# EAGLE design SenseLora Soil Moisture V1.0 (EAGLE 6.1)
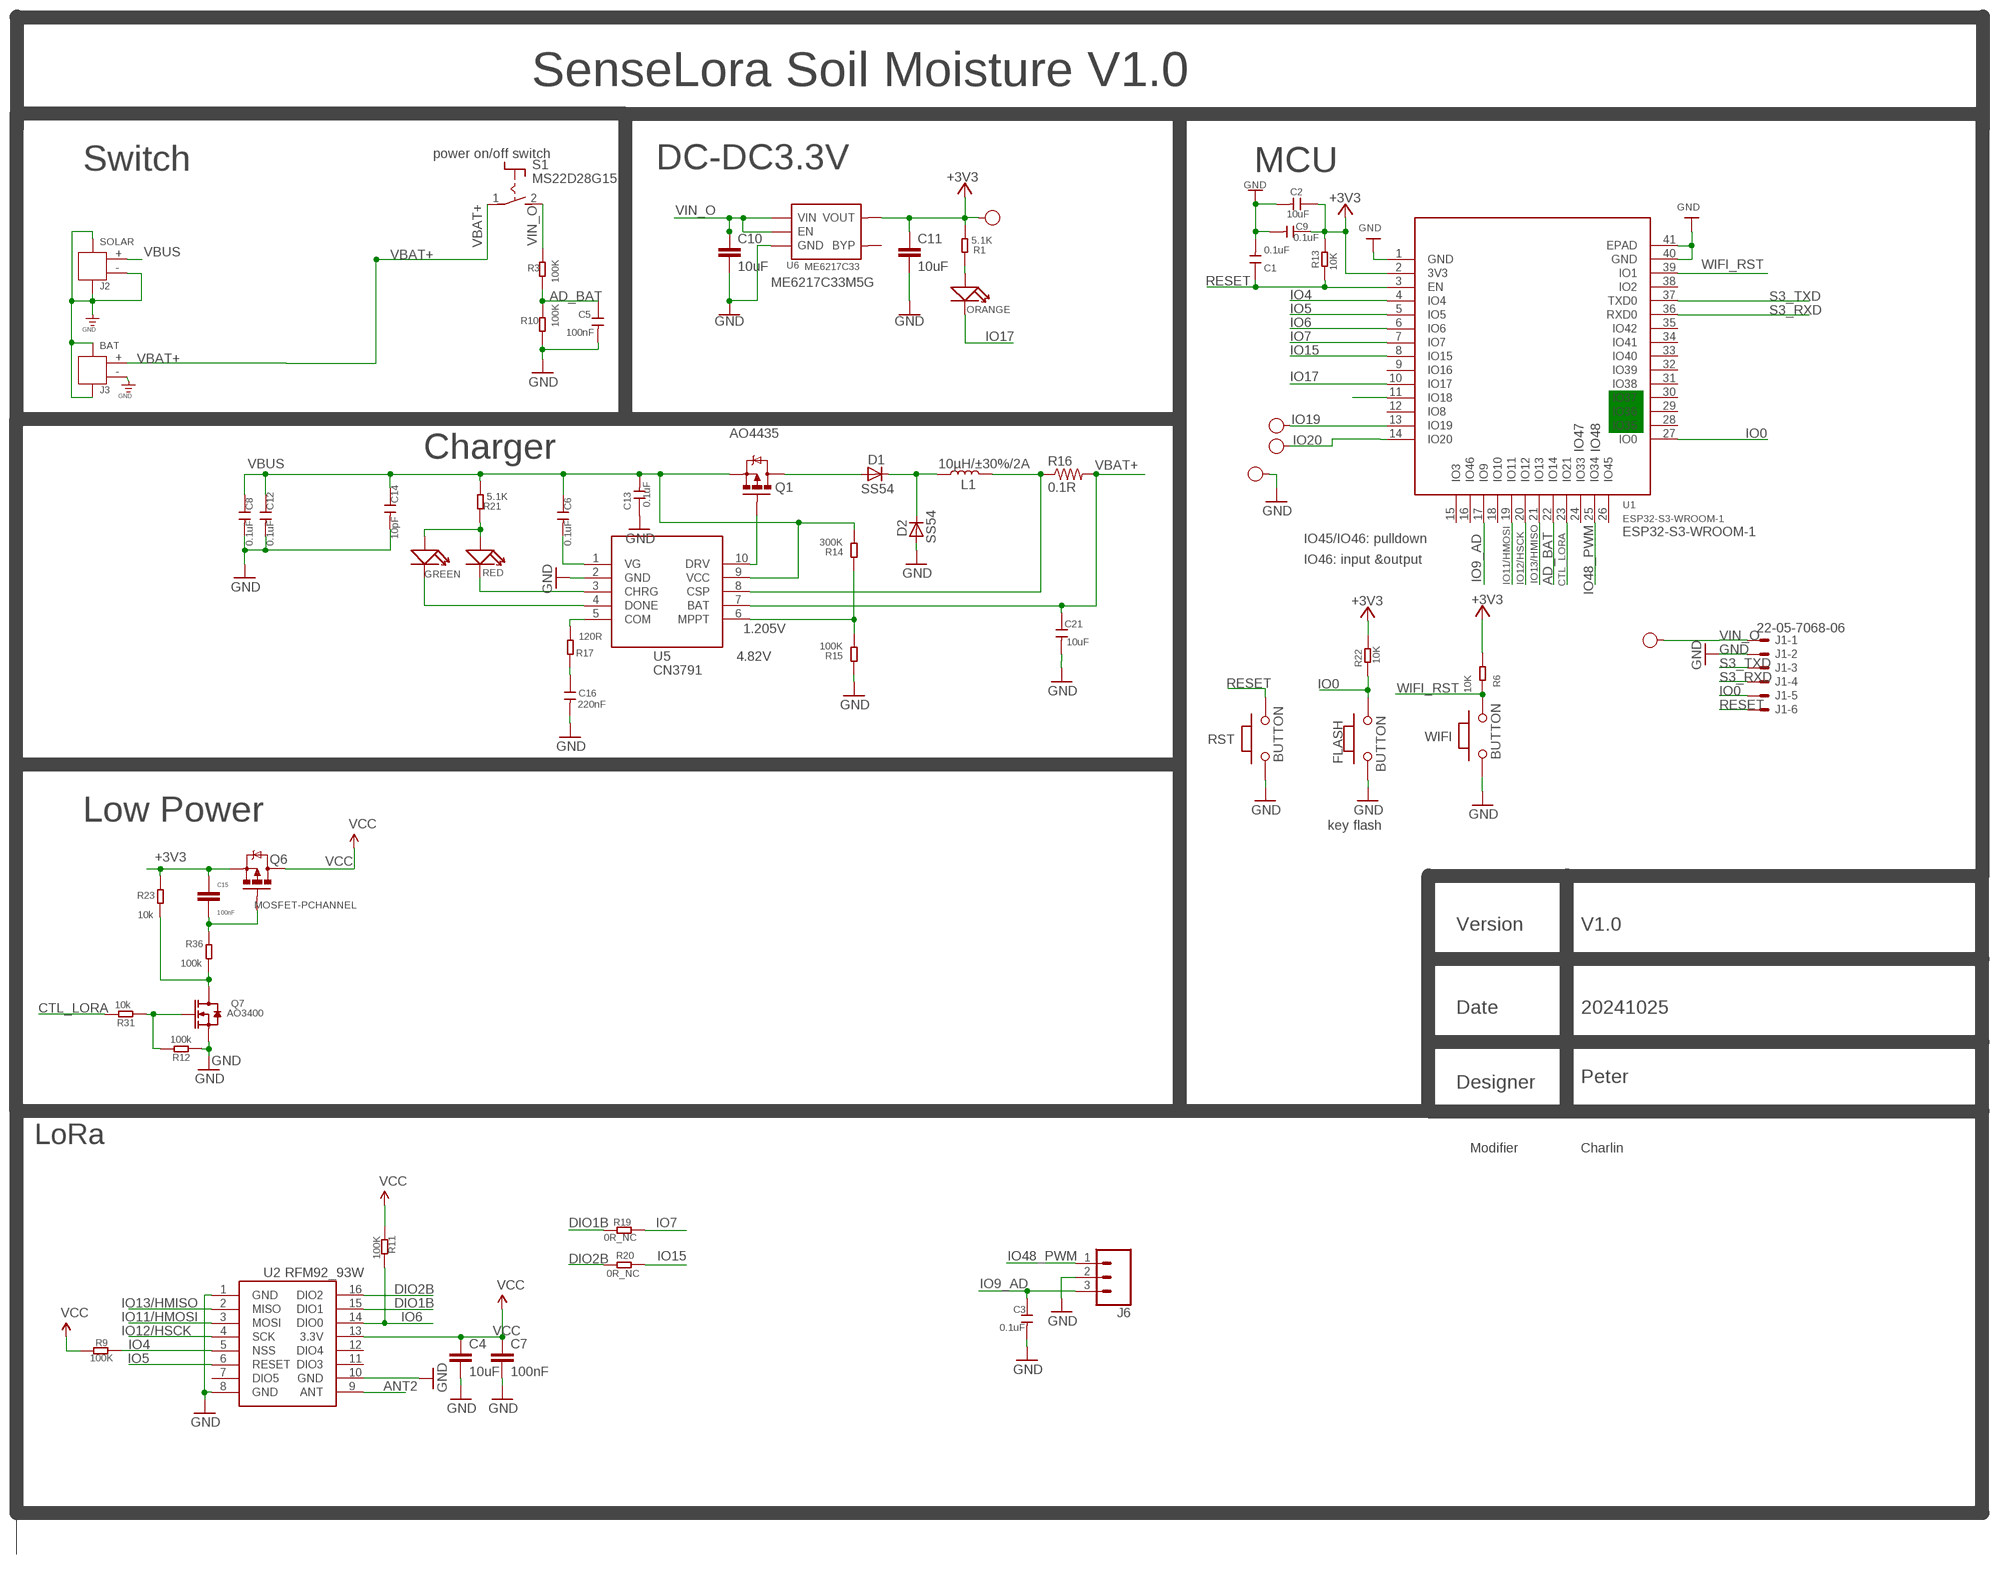
[diagram p0: schematic, sheet 1]

## Parts
3V3  TEST-POINT'4545'  [TP-D45MIL]
C1  0.1uF  DISCRETE_C-0603  [DISCRETE_C0603]
C2  10uF  DISCRETE_C-0603  [DISCRETE_C0603]
C3  0.1uF  DISCRETE_C-0603  [DISCRETE_C0603]
C4  10uF  C0603  [C0603]
C5  100nF  CAP-0603  [C0603]
C6  0.1uF  DISCRETE_C-0603  [DISCRETE_C0603]
C7  100nF  C0603  [C0603]
C8  0.1uF  DISCRETE_C-0603  [DISCRETE_C0603]
C9  0.1uF  DISCRETE_C-0603  [DISCRETE_C0603]
C10  10uF  C0603  [C0603]
C11  10uF  C0603  [C0603]
C12  0.1uF  DISCRETE_C-0603  [DISCRETE_C0603]
C13  0.1uF  DISCRETE_C-0603  [DISCRETE_C0603]
C14  10pF  DISCRETE_C-0603  [DISCRETE_C0603]
C15  100nF  C0603  [C0603]
C16  220nF  DISCRETE_C-0603  [DISCRETE_C0603]
C21  10uF  DISCRETE_C-0603  [DISCRETE_C0603]
CHRG  RED  LED'0603'  [LED-0603]
D1  SS54  DIODE-DO-214AC  [DO-214AC]
D2  SS54  DIODE-DO-214AC  [DO-214AC]
D+  TEST-POINT'4545'  [TP-D45MIL]
D-  TEST-POINT'4545'  [TP-D45MIL]
DONE  GREEN  LED'0603'  [LED-0603]
FLASH  BUTTON  PB157  [157SW]
GND  TEST-POINT'4545'  [TP-D45MIL]
J1  22-05-7068-06  [7395-06]
J2  SOLAR  JST-2P-SMD'2.0'  [HW2-SMD-2.0-90D]
J3  BAT  JST-2P-SMD'2.0'  [HW2-SMD-2.0-90D]
J6  CONN_03SCREW  [SCREWTERMINAL-3.5MM-3]
L1  10µH/±30%/2A  INDUCTOR-CR54-3.3UH  [CR54]
Q1  MOSFET-PCHANNELFDS6675  [SO08]
Q6  MOSFET-PCHANNEL  [SOT23-3]
Q7  AO3400  MOSFET-N'SOT23'  [SOT23@1]
R1  5.1K  DISCRETE_R-0603  [DISCRETE_R0603]
R3  100K  R-0603  [R0603]
R6  10K  R-0603  [R0603]
R9  100K  R-0603  [R0603]
R10  100K  R-0603  [R0603]
R11  100K  R-0603  [R0603]
R12  100k  R-0603  [R0603]
R13  10K  R-0603  [R0603]
R14  300K  DISCRETE_R-0603  [DISCRETE_R0603]
R15  100K  DISCRETE_R-0603  [DISCRETE_R0603]
R16  0.1R  R-US_R1206  [R1206]
R17  120R  DISCRETE_R-0603  [DISCRETE_R0603]
R19  0R_NC  R-0603  [R0603]
R20  0R_NC  R-0603  [R0603]
R21  5.1K  DISCRETE_R-0603  [DISCRETE_R0603]
R22  10K  R-0603  [R0603]
R23  10k  R-0603  [R0603]
R31  10k  R-0603  [R0603]
R36  100k  R-0603  [R0603]
RST  BUTTON  PB157  [157SW]
S1  MS22D28G15  [S-MS22D28G15]
STA  ORANGE  LED'0603'  [LED-0603]
U1  ESP32-S3-WROOM-1  ESP32­S2­SOLO  [ESP32-­S2-­SOLO]
U2  RFM92_93W  [RFM92_93W]
U5  CN3791  [SSOP-10-150MIL]
U6  ME6217C33  SPX3819  [SOT23-5]
VI  HP  TEST-POINT'4545'  [TP-D45MIL]
WIFI  BUTTON  PB157  [157SW]

## Nets
+3V3: 3V3.T C2.1 C9.1 C11.1 C15.1 Q6.2(S) R1.2 R6.2 R13.2 R22.2 R23.2 U1.2(3V3) U6.5(VOUT)
AD_BAT: C5.1 R3.2 R10.1 U1.22(IO14)
ANT2: U2.9(ANT)
CTL_LORA: R31.2 U1.23(IO21)
DIO1B: R19.2 U2.15(DIO1)
DIO2B: R20.2 U2.16(DIO2)
GND: C1.2 C2.2 C3.2 C4.2 C5.2 C7.2 C8.2 C9.2 C10.2 C11.2 C12.2 C13.1 C14.2 C16.2 C21.2 D2.A FLASH.1 GND.T J1.2 J2.3 J2.4 J2.- J3.3 J3.4 J3.- J6.2 Q7.2(S) R10.2 R12.1 R15.1 RST.1 U1.1(GND) U1.40(GND) U1.41(EPAD) U2.1(GND) U2.8(GND) U2.10(GND) U5.2(GND) U6.2(GND) WIFI.1
IO0: FLASH.2 J1.5 R22.1 U1.27(IO0)
IO4: R9.1 U1.4(IO4) U2.5(NSS)
IO5: U1.5(IO5) U2.6(RESET)
IO6: R11.1 U1.6(IO6) U2.14(DIO0)
IO7: R19.1 U1.7(IO7)
IO9_AD: C3.1 J6.3 U1.17(IO9)
IO11/HMOSI: U1.19(IO11) U2.3(MOSI)
IO12/HSCK: U1.20(IO12) U2.4(SCK)
IO13/HMISO: U1.21(IO13) U2.2(MISO)
IO15: R20.1 U1.8(IO15)
IO17: STA.- U1.10(IO17)
IO19: D-.T U1.13(IO19)
IO20: D+.T U1.14(IO20)
IO48_PWM: J6.1 U1.25(IO34)
N$1: R14.1 R15.2 U5.6(MPPT)
N$2: Q1.4(G) U5.10(DRV)
N$3: C6.2 U5.1(VG)
N$4: D1.C D2.C L1.P$1
N$5: D1.A Q1.5(D) Q1.6(D) Q1.7(D) Q1.8(D)
N$6: CHRG.+ DONE.+ R21.1
N$7: DONE.- U5.4(DONE)
N$8: CHRG.- U5.3(CHRG)
N$9: R17.2 U5.5(COM)
N$10: C16.1 R17.1
N$11: R1.1 STA.+
N$12: U1.11(IO18)
N$13: C15.2 Q6.1(G) R36.2
N$14: Q7.1(G) R12.2 R31.1
N$15: L1.P$2 R16.1 U5.8(CSP)
N$18: Q7.3(D) R23.1 R36.1
RESET: C1.1 J1.6 R13.1 RST.2 U1.3(EN)
S3_RXD: J1.4 U1.36(RXD0)
S3_TXD: J1.3 U1.37(TXD0)
VBAT+: C21.1 J3.+ R16.2 S1.1(P) U5.7(BAT)
VBUS: C6.1 C8.1 C12.1 C13.2 C14.1 J2.+ Q1.1(S) Q1.2(S) Q1.3(S) R14.2 R21.2 U5.9(VCC)
VCC: C4.1 C7.1 Q6.3(D) R9.2 R11.2 U2.13(3.3V)
VIN_O: C10.1 J1.1 R3.1 S1.2(S) U6.1(VIN) U6.3(EN) VI.T
WIFI_RST: R6.1 U1.39(IO1) WIFI.2
Unconnected: U1.9(IO16) U1.12(IO8) U1.15(IO3) U1.16(IO46) U1.18(IO10) U1.24(IO33) U1.26(IO45) U1.28(IO35) U1.29(IO36) U1.30(IO37) U1.31(IO38) U1.32(IO39) U1.33(IO40) U1.34(IO41) U1.35(IO42) U1.38(IO2) U2.7(DIO5) U2.11(DIO3) U2.12(DIO4) U6.4(BYP)

## Notes on the sheet
- SenseLora Soil Moisture V1.0
- power on/off switch
- Switch | DC-DC3.3V | MCU
- ME6217C33M5G
- AO4435
- IO47 | IO48
- Charger
- ESP32-S3-WROOM-1
- IO45/IO46: pulldown
- IO46: input &output
- 1.205V
- 4.82V
- Low Power
- key flash
- Version | V1.0
- Date | 20241025
- Designer | Peter
- LoRa
- Modifier | Charlin

## Library data of the parts
3V3 D+ D- GND VI = Discrete-new:TEST-POINT; PARTNO: DNP
C1-C3 C6 C8 C9 C12-C14 C16 C21 = A9G:DISCRETE_C*: Ceramic Capacitors
C4 C7 C10 C11 C15 = Makerfabs-Peter:C0603
C5 = Discrete-new:CAP: Ceramic Capacitors
CHRG DONE STA = Discrete:LED*
D1 D2 = diode:DIODE-: DIODE
FLASH RST WIFI = MySMD:PB157
J1 = con-molex:22-?-06: CONNECTOR wire to board 2.54 mm (.1 inch) pitch header; OC_FARNELL: unknown; OC_NEWARK: unknown
J2 J3 = Connector-new:JST-2P-SMD: 2P-SMD-1.0-90D:320110054;2P-SMD-2.0-90D:320110026
J6 = SparkFun-Connectors:CONN_03: Multi connection point. Often used as Generic Header-pin footprint for 0.1 inch spaced/style header connections On any of the 0.1 inch spaced packages, you can populate with these: Break Away Headers - Straight <https://www.sparkfun.com/products/116> (PRT-00116) Break Away Male Headers - Right Angle <https://www.sparkfun.com/products/553> (PRT-00553) Female Headers <https://www.sparkfun.com/products/115> (PRT-00115) Break Away Headers - Machine Pin <https://www.sparkfun.com/products/117> (PRT-00117) Break Away Female Headers - Swiss Machine Pin <https://www.sparkfun.com/products/743> (PRT-00743) Stackable Header - 3 Pin (Female, 0.1") <https://www.sparkfun.com/products/13875> (PRT-13875) For SCREWTERMINALS and SPRING TERMINALS visit here: Screw Terimnals on SparkFun.com <https://www.sparkfun.com/search/results?term=Screw+Terminals> (5mm/3.5mm/2.54mm spacing) This device is also useful as a general connection point to wire up your design to another part of your project. Our various solder wires solder well into these plated through hole pads. Hook-Up Wire - Assortment (Stranded, 22 AWG) <https://www.sparkfun.com/products/11375> (PRT-11375) Hook-Up Wire - Assortment (Solid Core, 22 AWG) <https://www.sparkfun.com/products/11367> (PRT-11367) View the entire wire category on our website here <https://www.sparkfun.com/categories/141> Special notes: Molex polarized connector foot print use with SKU : PRT-08232 with associated crimp pins and housings.; PROD_ID: CONN-08288; SF_ID: PRT-08235
L1 = SparkFun-Coils:INDUCTOR: Inductors Resist changes in electrical current. Basically a coil of wire. SparkFun Products: SparkFun Load Cell Amplifier - HX711 <https://www.sparkfun.com/products/13879> IOIO-OTG - V2.2 <https://www.sparkfun.com/products/13613>; PROD_ID: NDUC-11157; VALUE: 3.3µH/±30%/3.4A
Q1 = User-Submitted:MOSFET-PCHANNEL: Generic PMOSFET IRLML2244 - TRANS-11153 (SOT-23 -20V -4.3A) (1.Gate 2.Source 3.Drain) FQP27P06 - COM-10349 <http://www.sparkfun.com/products/10349> (TO-220 -60V -27A) (1.Gate 2.Source 3.Drain)
Q6 = User-Submitted:MOSFET-PCHANNEL: Generic PMOSFET IRLML2244 - TRANS-11153 (SOT-23 -20V -4.3A) (1.Gate 2.Source 3.Drain) FQP27P06 - COM-10349 <http://www.sparkfun.com/products/10349> (TO-220 -60V -27A) (1.Gate 2.Source 3.Drain); PROD_ID: TRANS-08285
Q7 = Discrete:MOSFET-N: IRLL014: http://www.vishay.com/docs/91319/sihll014.pdf
R1 R14 R15 R17 R21 = A9G:DISCRETE_R*
R3 R6 R9-R13 R19 R20 R22 R23 R31 R36 = Discrete:R*
R16 = resistor:R-US_: RESISTOR, American symbol
S1 = Makerfabs-Peter:MS22D28G15
U1 = self:ESP32­S2­SOLO
U2 = dragino:RFM92_93W
U5 = sale:CN3791
U6 = IC:SPX3819

## Net classes
0 default: width 0.203 mm, drill 0.305 mm, clearance 0.152 mm

## Board
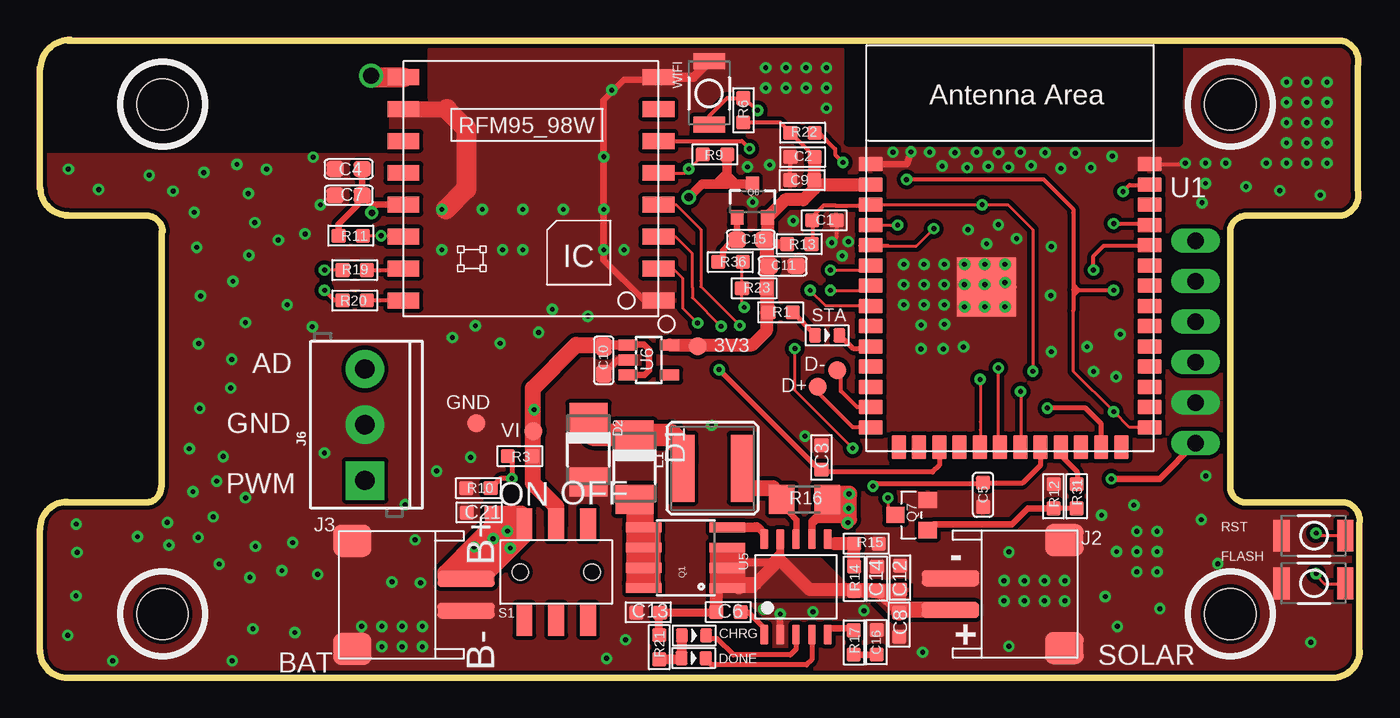
[diagram p1: board, top side]
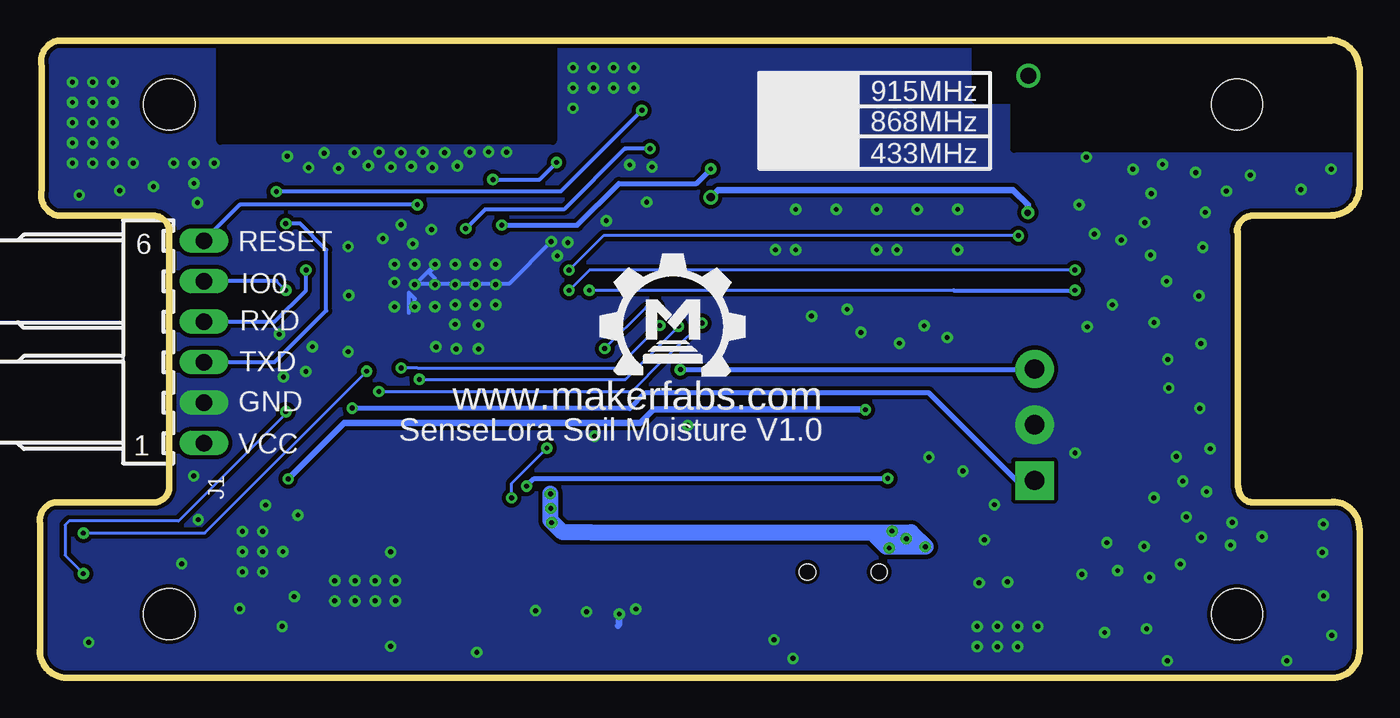
[diagram p2: board, bottom side, seen from below]

Size 82.82 x 40.04 mm. Coordinates in mm from the lower left corner, seen from the top.
Outline: 81.11,0 1.72,0 arc-90 0.02,1.7
Outline: 0,1.57 0,9.3
Outline: 0,30.7 0,38.3
Outline: 1.77,40 81.7,40 arc-90 82.7,38.4 82.7,30.6 arc-90 81.7,29 75.7,29 arc90 74.7,28 74.7,12 arc90 75.7,11 81.9,11 arc-90 82.8,9.7 82.8,1.5
Outline: 1.6,29 6.7,29 arc-90 7.7,28
Outline: 1.59,11 6.7,11 arc90 7.6,12
Outline: 7.64,28 7.64,12
Outline: 1.72,11.05 arc90 0.02,9.35
Outline: 0.04,30.74 arc90 1.74,29.04
Outline: 1.94,40.04 arc90 0.04,38.24
Outline: 81.12,0 arc90 82.82,1.7
Copper layers (1*16): Top 0.035mm / dielectric 1.5mm / Bottom 0.035mm
Design rules: minimum track width 8mil, minimum drill 12mil, track to track 8mil, track to pad 8mil, pad to pad 8mil, via to via 8mil, smd to smd 0mil, copper to edge 8mil, drill to drill 8mil, minimum pad ring 10mil, minimum via ring 8mil, stop-mask expansion 4mil, vias tented up to drill 100mil, thermal gap 0mil
Holes 3.2 mm at 7.7,4 74.7,4 7.7,36 74.7,36
tRestrict: area 50.7,33.6 to 71.5,40; area 3.9,36.3 to 24.1,39.6; area -1.2,33.2 to 21.7,40.8
bRestrict: area 50.6,33.7 to 71.5,40; area 3.9,36.3 to 24.1,39.6; area -1.2,33.2 to 21.7,40.8

### Footprints (pad centres in the part's own frame; a part is rotated, then mirrored left to right if it is on the bottom)
TP-D45MIL = smd 1.143 x 1.143: T 0,0
DISCRETE_C0603 = smd 0.889 x 0.889: 1 -0.762,0; 2 0.762,0
C0603 = smd 1.1 x 1: 1 -0.85,0; 2 0.85,0
C0603' = smd 0.889 x 0.889: 1 0,0.762; 2 0,-0.762
LED-0603 = smd 0.762 x 0.889: + -0.762,0; - 0.762,0
DO-214AC = smd 1.8 x 2.4: A 2.025,0; C -2.025,0
157SW = smd 1.016 x 1.981: 1 0,0; 2 4,0
7395-06 = drill 1.016 long: 1 6.35,0; 2 3.81,0; 3 1.27,0; 4 -1.27,0; 5 -3.81,0; 6 -6.35,0
HW2-SMD-2.0-90D = smd 2 x 2.4: 3 3.4,-2.181; 4 -3.4,-2.181 | smd 1 x 3.6: + -1,4.953; - 1,4.953
SCREWTERMINAL-3.5MM-3 = drill 1.2 pad 2.413 square: 1 0,0 | drill 1.2 pad 2.413: 2 3.5,0; 3 7,0
CR54 = smd 4.2 x 1.4: P$1 0,1.85; P$2 0,-1.85
SO08 = smd 0.61 x 2.21: 1 -1.905,-2.616; 2 -0.635,-2.616; 3 0.635,-2.616; 4 1.905,-2.616; 5 1.905,2.616; 6 0.635,2.616; 7 -0.635,2.616; 8 -1.905,2.616
SOT23-3 = smd 0.8 x 0.9: 1 -0.95,-1; 2 0.95,-1; 3 0,1.1
SOT23@1 = smd 1.016 x 1.143: 1 -0.95,-1.016; 2 0.95,-1.016; 3 0,1.016
DISCRETE_R0603 = smd 0.889 x 0.889: 1 -0.762,0; 2 0.762,0
R0603 = smd 0.889 x 0.889: 1 -0.762,0; 2 0.762,0
R1206 = smd 1.6 x 1.803: 1 -1.422,0; 2 1.422,0
S-MS22D28G15 = smd 1 x 2: 1 -2,3; 2 0,3; 3 2,3; 4 2,-3; 5 0,-3; 6 -2,-3 | hole 1: 2.25,0; -2.25,0
ESP32-­S2-­SOLO = smd 1.5 x 0.9: 1 -8.75,5.26; 2 -8.75,3.99; 3 -8.75,2.72; 4 -8.75,1.45; 5 -8.75,0.18; 6 -8.75,-1.09; 7 -8.75,-2.36; 8 -8.75,-3.63; 9 -8.75,-4.9; 10 -8.75,-6.17; 11 -8.75,-7.44; 12 -8.75,-8.71; 13 -8.75,-9.98; 14 -8.75,-11.25; 27 8.75,-11.25; 28 8.75,-9.98; 29 8.75,-8.71; 30 8.75,-7.44; 31 8.75,-6.17; 32 8.75,-4.9; 33 8.75,-3.63; 34 8.75,-2.36; 35 8.75,-1.09; 36 8.75,0.18; 37 8.75,1.45; 38 8.75,2.72; 39 8.75,3.99; 40 8.75,5.26 | smd 0.9 x 1.5: 15 -6.985,-12.5; 16 -5.715,-12.5; 17 -4.445,-12.5; 18 -3.175,-12.5; 19 -1.905,-12.5; 20 -0.635,-12.5; 21 0.635,-12.5; 22 1.905,-12.5; 23 3.175,-12.5; 24 4.445,-12.5; 25 5.715,-12.5; 26 6.985,-12.5 | smd 3.7 x 3.7: 41 -1.5,-2.46
RFM92_93W = smd 2 x 1: 1 -8,7; 2 -8,5; 3 -8,3; 4 -8,1; 5 -8,-1; 6 -8,-3; 7 -8,-5; 8 -8,-7; 9 8,-7; 10 8,-5; 11 8,-3; 12 8,-1; 13 8,1; 14 8,3; 15 8,5; 16 8,7
SSOP-10-150MIL = smd 1.27 x 0.5: 1 -3,2; 2 -3,1; 3 -3,0; 4 -3,-1; 5 -3,-2; 6 3,-2; 7 3,-1; 8 3,0; 9 3,1; 10 3,2
SOT23-5 = smd 0.69 x 1.2: 1 -0.95,-1.3; 2 0,-1.3; 3 0.95,-1.3; 4 0.95,1.3; 5 -0.95,1.3

### Placement (x,y rotation side)
3V3  41.28,20.82 0 top
C1  49.22,28.71 0 top
C2  47.86,32.69 180 top
C3  49.05,13.83 90 top
C4  19.38,31.94 180 top
C5  100nF  [C0603']  59.19,11.49 0 top
C6  43.21,4.13 0 top
C7  19.38,30.29 180 top
C8  53.93,3.34 270 top
C9  47.84,31.24 180 top
C10  35.39,19.93 270 top
C11  46.61,25.85 0 top
C12  53.98,6.29 90 top
C13  38.18,4.1 0 top
C14  52.53,6.21 90 top
C15  44.61,27.5 180 top
C16  52.5,2.23 90 top
C21  27.56,10.38 180 top
CHRG  41.05,2.65 0 top
D1  37.32,13.22 270 top
D2  34.43,14.32 270 top
D+  48.82,18.28 0 top
D-  50.04,19.32 0 top
DONE  41.02,1.23 0 top
FLASH  77.92,5.93 0 top
GND  27.38,15.96 0 top
J1  72.52,21.08 270 bottom
J2  62.1,5.25 90 top
J3  21.79,5.21 270 top
J6  20.4,12.38 90 top
L1  42.22,13.14 90 top
Q1  40.52,7.53 90 top
Q6  44.71,29.89 0 top
Q7  54.7,10.22 90 top
R1  46.49,22.95 180 top
R3  30.13,13.91 180 top
R6  44.15,35.62 270 top
R9  42.36,32.86 0 top
R10  27.52,11.9 180 top
R11  19.51,27.75 180 top
R12  63.61,11.39 270 top
R13  47.66,27.23 180 top
R14  51.1,6.21 270 top
R15  51.87,8.42 180 top
R16  47.98,11.19 0 top
R17  51.08,2.22 90 top
R19  19.77,25.59 0 top
R20  19.77,23.69 0 top
R21  38.87,1.92 90 top
R22  47.86,34.21 180 top
R23  44.83,24.45 0 top
R31  65.06,11.39 90 top
R36  43.34,26.1 180 top
RST  77.92,8.92 0 top
S1  32.4,6.64 0 top
STA  49.41,21.5 0 top
U1  60.88,26.97 0 top
U2  30.81,30.69 180 top
U5  47.45,5.7 90 top
U6  38.21,19.95 270 top
U$3  [MAKERFABS_0.3]  47.22,18.99 0 bottom
VI  30.97,15.48 0 top
WIFI  42,38.71 270 top

### Tracks (layer width: path | path; a pad name or v marks a point on that pad's centre or on a via)
+3V3
  Top 0.203: 44.66,20.9 44.7,20.9 44.71,20.89 | 45.59,21.77 45.59,22.18 45.83,22.42 45.83,22.44 C11.1
  Top 0.254: 48.88,32.94 C2.1 R22.2 46.45,34.86 R6.2
  Top 0.305: 3V3.T 41.2,20.89 U6.5 | R1.2 45.7,22.95 45.67,22.92 45.59,22.92
  Top 0.406: 46.09,27.23 45.88,27.01 45.6,27.01 45.59,27.02 | 45.59,27.02 45.57,27.04 | 45.59,27.02 45.55,27.02 C15.1
  Top 0.61: R13.2 45.51,27.23 45.44,27.17
  Top 0.813: C2.1 C9.1 48.7,30.96 | 48.7,30.96 U1.2 | 48.7,30.96 48.59,30.86 48.59,30.7 47.91,30.01 46.78,30.01 Q6.2 45.66,23.01 R1.2 | U6.5 44.66,20.9 | 44.71,20.89 45.59,21.77 45.59,22.92 R23.2 45.59,27.02 45.57,27.04 45.44,27.17
AD_BAT  (via drill 0.3)
  Top 0.305: U1.22 62.79,13.34 61.65,12.21 59.21,12.21 | 59.21,12.21 59.19,12.23 C5.1 59.14,12.25 59.11,12.28 | 59.11,12.28 58.88,12.51 59.11,12.28 | R10.1 28.9,12.51 v29.62,12.51 29.62,13.66 R3.2 | v52.28,12.03 52.46,12.21 59.21,12.21 | 59.21,12.21 59.14,12.28 59.11,12.28 | 59.11,12.28 59.08,12.28 59.11,12.28
  Bottom 0.305: v52.28,12.03 51.79,12.51 v29.62,12.51
ANT2  (via drill 1)
  Top 0.254: 20.79,37.69 20.78,37.7 v20.78,37.78
  Top 1.27: 20.79,37.69 U2.9
CTL_LORA
  Top 0.254: 65.08,12.15 R31.2
  Top 0.305: U1.23 64.06,13.96 65.1,12.92 65.1,12.18 65.08,12.15
DIO1B
  Top 0.254: R19.2 22.71,25.59 U2.15
DIO2B
  Top 0.254: U2.16 R20.2
GND  (via drill 0.3)
  Top 0.254: C9.2 C2.2 | U1.40 71.81,32.23 v71.88,32.3 | U2.8 39.03,37.69 39.2,37.53 | 61.12,24.51 60.74,24.64 v60.56,24.81 60.44,24.81 | 60.44,24.81 v59.29,25.96 | 60.44,24.81 60.44,25.83 v60.56,25.96 | v60.56,23.29 v59.29,23.29 58.66,23.29 | C1.2 49.98,27.62 v49.69,27.33
  Top 0.406: U2.1 38.68,23.56 | 39.2,37.53 36.66,37.53 35.39,36.26 v35.39,32.7 v35.39,29.4 35.39,26.21 37.9,23.7 38.7,23.7 38.8,23.6 | U1.41 61.12,24.51 | U1.1 54.4,32.23 v54.67,33.01 | U6.2 36.26,19.95 C10.2 | U5.2 46.45,3.79 v46.46,4
  Top 0.61: 39.03,37.69 41.01,37.69 41.99,38.67
  Top 1.016: U2.10 25.54,35.69
  Top 1.27: 25.54,35.69 26.75,34.48 26.75,30.67 25.48,29.4
  Bottom 0.254: 57.9,26.08 v58.02,25.96 58.02,25.93 | 58.02,25.93 59.32,24.64 | 58.02,25.93 58.02,25.83 58.41,25.45 58.02,25.07 v58.02,24.69 | v59.29,23.29 59.29,23.8 59.68,24.18 59.68,22.91 | v50.73,27.38 53.39,24.73 59.31,24.73
  Bottom 0.406: v46.46,4 46.46,3.34 46.54,3.26
  other vias: 56.69,20.64 17.43,6.49 35.89,36.89 59.29,24.69 9.68,29.21 58.02,23.29 63.48,27.07 8.36,30.55 57.96,20.77 11.1,12.34 1.75,2.66 17.1,22.04 31.3,21.68 56.77,22.19 66.85,5.1 67.62,3.22 73.15,31.03 73.92,7.16 42.16,15.84 23.55,8.66 50.35,26.49 20.19,3.22 21.46,3.22 24,3.22 22.73,3.22 24,1.95 22.73,1.95 21.46,1.95 25.88,21.36 15.19,6.73 1.79,31.93 11.51,13.89 10.29,31.72 12.07,1.06 3.68,30.65 4.57,1.06 16.64,27.86 17.15,32.68 54.21,25.96 55.48,25.96 56.75,25.96 56.75,24.69 56.75,23.42 64.07,31.98 72.93,29.82 63.43,24 72.88,9.93 73.16,12.67 67.3,32.74 66.13,19.23 80.35,30.3 65.72,20.77 55.48,23.42 54.21,23.42 55.48,24.69 54.21,24.69 32.85,29.4 30.31,29.4 27.77,29.4 25.23,29.4 6.12,8.86 2.34,7.87 22.1,6.01 27.03,13.84 2.29,9.65 15.52,23.41 9.96,20.97 12.04,19.98 12.12,24.89 8.1,8.33 8,9.75 11.25,7.13 28.88,21 17.86,14.12 14.96,27.48 16,2.84 13.18,6.29 67.54,18.89 9.38,14.38 14.23,31.92 6.86,31.54 78.23,37.38 79.5,37.38 80.77,37.38 80.77,36.11 80.77,34.84 80.77,33.57 80.77,32.3 79.5,32.3 78.23,32.3 79.5,33.57 78.23,33.57 79.5,34.84 78.23,34.84 79.5,36.11 78.23,36.11 76.96,32.3 75.69,30.83 74.42,32.3 73.15,32.3 60.5,4.82 61.77,4.82 63.04,4.82 64.31,4.82 64.31,6.09 60.81,1.98 63.04,6.09 61.77,6.09 60.5,6.09 36.75,2.38 70.11,6.65 68.83,6.65 79.76,2.23 55.3,20.64 60.81,7.89 70.11,7.92 70.11,9.19 68.83,7.92 67.56,7.92 68.83,9.19 46.82,38.29 48.09,38.29 49.36,38.29 49.36,37.02 49.36,35.75 45.55,38.29 58.25,28.13 45.55,37.02 46.82,37.02 48.09,37.02 30.31,26.86 35.39,26.86 25.23,26.86 29.04,26.86 36.66,26.86 2.26,5.14 10.88,10.1 10.03,16.91 67.79,21.56 13.08,30.4 10.08,23.97 9.6,11.68 12.9,22.3 27.33,22.09 34.39,22.7 32.16,23.13 12.91,11.3 11.98,18.19 13.12,26.52 23.89,5.95 9.93,8.81 66.63,10.21 24.89,12.97 68.66,10.84 63.48,20.47 35.56,1.21 13.49,28.57 70.28,4.34 22.92,10.87 13.37,3.07 13.52,8.25 9.84,27.02 15.86,8.48 48.02,15.16 55.4,1.59 55.31,22.15 47.27,28.69 45.8,32.2 44.4,32.07 44.73,29.86 48.52,4.13 45.42,4.31 51.72,4.21 17.6,29.69 12.37,32.23 77.81,30.58 53.53,32.99 55.84,32.99 57.41,32.97 58.79,32.99 60.16,32.97 61.53,32.99 63.08,32.97 64.98,32.94 65.95,32.03 56.62,32.13 58.19,32.02 59.51,32.1 60.78,32.05 61.29,27.57 59.41,27.24 60.15,28.44 62.21,32.15
  pour Bottom (isolate 0.254, rank 6): -5,49.72 91.52,49.72 91.52,42.1 91.52,-6.16 -5,-6.16
  pour Top (isolate 0.254, rank 6): -2.46,47.18 88.98,47.18 88.98,39.56 88.98,-3.62 -2.46,-3.62
IO0  (via drill 0.3)
  Top 0.203: U1.27 68.37,15.72 v67.39,16.7 64.85,19.24 64.85,23.05 | v80.09,6.54 80.09,6.41 80.6,5.91 82.12,5.91 FLASH.2
  Top 0.254: R22.1 48.88,34.21 49.9,33.2 49.9,32.85 v50.4,32.35 | 64.85,29.4 64.85,29.17 | 64.85,29.17 64.85,24.35 | 64.85,24.35 64.85,23.05 | v67.39,24.32 65.18,24.32 | 65.18,24.32 64.9,24.32 64.88,24.35 64.85,24.35 | 64.88,24.65 65.18,24.35 65.18,24.32 | 65.18,24.32 64.88,24.02 | 64.85,29.17 64.85,29.43 63,31.28 v54.39,31.28
  Bottom 0.203: v67.39,16.7 67.39,16.57 74.12,9.84 80.98,9.84 81.23,9.59 81.23,7.68 v80.09,6.54 | 67.98,24.91 v67.39,24.32
  Bottom 0.254: 67.98,24.91 72.52,24.91 72.55,24.88 72.53,24.88 J1.5 | v54.39,31.28 51.46,31.28 v50.4,32.35
IO4  (via drill 0.3)
  Top 0.203: R9.1 41.6,32.82 v40.72,31.94 40.47,31.69 U2.5 | U1.4 53.82,28.42 v53.83,28.41
  Top 0.254: 38.18,31.94 38.43,31.69 U2.5
  Bottom 0.203: 41.36,31.31 v40.72,31.94
  Bottom 0.305: v53.83,28.41 49.1,28.41 46.49,31.03 41.61,31.03 40.75,31.89 40.75,31.92 v40.72,31.94
IO5  (via drill 0.3)
  Top 0.203: 53.2,27.1 55,27.1 v56.09,28.19
  Top 0.254: U2.6 44.05,33.69 v44.53,33.21 | 53.2,27.1 51.49,27.1 U1.5
  Bottom 0.254: v44.53,33.21 46.07,33.21 46.13,33.21 49.94,29.4 54.87,29.4 v56.09,28.18 v56.09,28.19
IO6  (via drill 0.3)
  Top 0.203: R11.1 v21.42,27.75 22.56,27.75 22.94,28.13 22.94,27.82 U2.14 | v49.61,25.59 52.15,25.59 52.13,25.61 U1.6
  Bottom 0.203: v21.42,27.75 47.45,27.75 v49.61,25.59
IO7  (via drill 0.3)
  Top 0.203: R19.1 v17.86,25.59 | v49.61,24.32 51.84,24.32 U1.7
  Bottom 0.203: v17.86,25.59 48.34,25.59 v49.61,24.32
IO9_AD  (via drill 0.3)
  Top 0.254: 49.05,12.92 C3.1
  Top 0.305: U1.17 56.44,13.34 56.01,12.92 49.05,12.92 v42.62,19.34
  Bottom 0.305: v42.62,19.34 28.02,19.34 20.35,19.34 20.36,19.34 J6.3
IO11/HMOSI  (via drill 0.3)
  Top 0.203: U2.3 39.89,27.69 39.91,27.67 | 59.01,14.5 U1.19 59.03,14.53 59.03,14.59 59.01,14.62 59.01,15.56 | 59.01,16.07 59.01,15.56 | v42.75,22.06 40.95,23.86 40.95,24.5 40.95,26.63 39.91,27.67 | 39.91,27.67 39.76,27.67 | 39.76,27.67 39.27,27.67 39.17,27.78 | v59.01,18.73 59.01,15.56 | 39.91,27.67 39.76,27.67
  Bottom 0.203: v59.01,18.73 46.08,18.73 v42.75,22.06 | v42.75,22.06 42.73,22.09 v42.75,22.06
IO12/HSCK  (via drill 0.3)
  Top 0.203: U2.4 39.92,29.69 41.48,28.13 41.48,24.93 41.48,24.55 v43.92,22.11 | 60.28,14.5 U1.20 60.56,14.78 60.15,15.19 v60.15,19.44 | v43.92,22.11 43.95,22.09 v43.92,22.11
  Bottom 0.203: v43.92,22.11 43.9,22.14 | 43.9,22.14 v43.92,22.11 | v43.92,22.11 43.9,22.14 | v43.92,22.11 46.59,19.44 47.63,19.44 59.11,19.44 v60.15,19.44
IO13/HMISO  (via drill 0.3)
  Top 0.203: U2.2 39.73,25.69 40.34,25.08 40.34,23.3 40.34,23.2 v41.28,22.26 | 61.8,14.69 61.75,14.64 61.73,14.64 61.57,14.49 61.54,14.49 U1.21 61.62,14.47 61.62,14.57 61.55,14.57 v61.55,17.97
  Top 0.254: U2.2 38.71,25.59
  Bottom 0.203: v41.28,22.26 43.64,20 45.67,17.97 v61.55,17.97
IO15  (via drill 0.3)
  Top 0.203: U1.8 49.32,23.34 v48.34,24.32
  Top 0.254: R20.1 18.5,23.69 v17.86,24.32
  Bottom 0.203: 25.48,24.32 v48.34,24.32
  Bottom 0.254: 25.48,24.32 v17.86,24.32
IO17
  Top 0.305: U1.10 51.97,20.64 51.06,20.64 50.22,21.48 50.19,21.48 STA.-
IO19
  Top 0.254: U1.13 51.28,16.99 50.27,18 50.27,19.09 D-.T
IO20
  Top 0.254: U1.14 51.02,15.72 48.75,18 48.75,18.15 48.82,18.23 D+.T
IO48_PWM  (via drill 0.3)
  Top 0.305: U1.25 66.6,15.28 66.6,15.94 65.61,16.93 v63.22,16.93
  Bottom 0.305: 44.1,17.89 44.05,17.89 | 44.05,17.89 28.02,17.89 27.05,17.89 21.52,12.36 20.43,12.36 J6.1 | v63.22,16.93 63.22,16.9 45.8,16.9 44.81,17.89 44.1,17.89 | 44.1,17.89 44.05,17.89 | 44.1,17.89 44.05,17.89
N$1
  Top 0.406: 49.89,8.42 49.73,8.42 U5.6
  Top 0.813: R14.1 R15.2 49.89,8.42
N$2
  Top 0.254: 44.96,9.44 45.01,9.44 45.06,9.49 | U5.10 45.45,8.95 45.44,8.95
  Top 0.508: 45.45,8.95 45.44,8.95 45.44,9.11 45.06,9.49 44.81,9.49
  Top 0.61: Q1.4 44.96,9.44
N$3
  Top 0.305: U5.1 45.45,3.11 45.39,3.16 44.43,4.13 C6.2
N$4
  Top 0.254: L1.P$1 40.36,13.6
  Top 0.406: 39.58,15.25 D1.C | D1.C 37.32,15.3 | D1.C
  Top 1.422: D2.C 34.77,15.25 D1.C 39.58,15.25 40.36,14.47 40.36,13.6
N$5
  Top 0.254: Q1.8 37.93,5.65 37.93,5.93
  Top 0.813: Q1.5 37.88,9.41 37.22,9.41 37.19,9.39 37.19,5.93 37.93,5.93 38.59,5.93 38.59,9.23 37.67,9.23 37.85,9.06 37.85,6.24 | 37.85,6.24 37.22,6.87 37.22,10.61 37.32,10.71 | 37.32,10.71 D1.A | Q1.6 37.9,10.73 37.88,10.71 37.32,10.71 | 37.85,6.24 38.13,6.52 38.13,11.16 37.9,10.94 Q1.7
N$6
  Top 0.254: 40.26,2.63 40.29,2.6 40.29,2.58
  Top 0.61: R21.1 40.24,1.16 40.29,1.21 40.29,2.53 | 40.29,2.53 40.29,2.58 40.24,2.63 40.24,2.58 40.29,2.53 | DONE.+ 40.26,2.63 CHRG.+
N$7
  Top 0.254: 41.74,1.21 41.79,1.21 DONE.-
  Top 0.305: U5.4 48.45,1.14 48.11,0.8 42.14,0.8 41.74,1.21
N$8
  Top 0.305: U5.3 47.45,1.79 47.1,1.44 43.51,1.44 42.5,2.45 42.02,2.45 CHRG.-
N$9
  Top 0.406: U5.5 49.45,2.93 49.64,3.11 50.88,3.11 50.98,3.01 51.01,2.98 R17.2
N$10
  Top 0.406: R17.1 52.49,1.45 C16.1
N$11
  Top 0.305: STA.+ 48.65,21.55 R1.1
N$13
  Top 0.203: R36.2 42.4,26.13 42.4,26.19 42.28,26.31 42.33,26.31 42.37,26.35 42.28,26.44 | 43.76,28.86 43.77,28.87 Q6.1
  Top 0.305: C15.2 43.67,27.5
  Top 0.406: R36.2 arc90 42.85,26.38 42.85,26.58 42.85,26.81 43.26,27.22 C15.2 43.76,28.86 43.77,28.87
N$14
  Top 0.305: R31.1 63.71,10.63 63.63,10.55
  Top 0.406: 63.71,10.63 63.63,10.63 | 63.63,10.63 R12.2 | R12.2 62.01,10.63 60.99,9.61 56.24,9.61 56.11,9.61 Q7.1 | R12.2 63.63,10.63
N$15
  Top 0.406: U5.8 47.48,8.73 47.48,9.92 46.99,10.4 46.99,10.63 46.56,11.06 R16.1 46.69,11.19
  Top 1.016: 46.69,11.19 45.98,11.9 44.53,11.9 44.07,12.36 L1.P$2
N$18  (via drill 0.3)
  Top 0.203: Q7.3 54.01,10.5 54.01,10.35 53.57,10.35 53.22,10.35 v53.22,11.29 | v51.01,14.41 47.38,18.05 v47.38,20.66 | v44.2,23.25 44.07,23.38 44.07,24.52 | 44.07,24.52 44.07,26.12 R36.1 | R23.1 44.07,24.65 44.07,24.52
  Bottom 0.203: v53.22,11.29 53.22,12.21 v51.01,14.41 | v47.38,20.66 44.78,23.25 v44.2,23.25
RESET  (via drill 0.3)
  Top 0.203: U1.3 v59.14,29.69 60.75,29.69 62.31,28.13 v62.31,19.24 | RST.2 80.25,8.92 v80.09,9.08
  Top 0.254: U1.3 51.38,29.64 49.9,29.64 49.19,29.64 48.49,28.94 48.49,28.66 | 48.49,28.66 48.49,27.34 48.44,27.29 48.44,27.25 R13.1 | C1.1 48.49,28.66
  Bottom 0.203: v80.09,9.08 72.47,9.08 v62.31,19.24 | 72.47,27.5 72.52,27.45 J1.6
  Bottom 0.254: v59.14,29.69 70.27,29.69 72.47,27.5
S3_RXD  (via drill 0.3)
  Top 0.254: v66.12,25.59 66.12,26.48 66.75,27.12 69.6,27.12 U1.36
  Bottom 0.254: J1.4 68.09,22.35 66.12,24.32 v66.12,25.59
S3_TXD  (via drill 0.3)
  Top 0.203: U1.37 69.68,28.39
  Top 0.254: v67.39,28.51 69.55,28.51 69.68,28.39
  Bottom 0.254: J1.3 68.09,19.81 64.85,23.05 64.85,26.86 66.5,28.51 v67.39,28.51
VBAT+  (via drill 0.3)
  Top 0.203: 30.33,8.85 30.33,8.88 30.33,8.85
  Top 0.254: v50.7,9.74 50.68,9.72 50.57,9.83 48.45,9.83 | 50.3,10.2 50.12,10.02 48.9,10.02 48.47,9.59 48.47,9.54 49.23,10.3 49.3,10.3 49.64,10.63 v50.75,10.63
  Top 0.305: 28.4,10.3 C21.1 | 29.93,9.39 29.75,9.21 v29.34,9.21 | 30.38,8.9 30.33,8.85
  Top 0.406: R16.2 49.41,10.81 49.3,10.71 | 30.38,8.9 30.33,8.85 30.43,8.95 30.38,8.95 30.28,8.85 30.23,8.85 v29.52,8.14
  Top 0.457: U5.7 48.45,9.83 49.1,10.48
  Top 0.813: 49.1,10.48 49.03,10.4 | 50.68,9.72 v50.7,9.74 50.88,9.92 50.88,11.47 50.8,11.54 50.35,11.54 50.3,11.49 50.3,10.2 50.32,10.17 49.33,10.17 49.3,10.2 49.3,10.3 49.3,10.71 | v27.26,8.22 27.26,8.27 | 30.33,8.85 30.06,8.59 | 30.33,8.85 30.33,9 30.38,9.06 | 30.33,8.85 30.33,9.57 S1.1 | 30.33,8.85 30.28,8.85 29.7,8.85 v29.34,9.21
  Top 1.016: S1.1 28.76,9.64 25.45,6.34 25.45,6.59 27.54,8.68 28.4,9.54 28.4,10.3 30.2,10.3 30.38,10.12 30.38,9.06 30.38,8.9 30.33,8.85 30.06,8.59 27.68,6.21 J3.+ 29.93,9.39 30,9.39 30.03,9.41 30.03,9.79 | v28.45,8.73 28.6,8.73 28.76,8.88 | v50.78,11.54 49.76,11.54 R16.2
  Bottom 0.254: 27.23,8.22 v27.26,8.22
  Bottom 0.305: 29.7,8.22 29.62,8.14 v29.52,8.14
  Bottom 1.016: v28.45,8.73 28.58,8.85 30.33,8.85 29.7,8.22 v27.26,8.22 27.23,8.22 28.15,9.13 48.29,9.13 50.02,9.13 50.78,9.89 v50.78,11.54
VBUS
  Top 0.254: 43.08,8.04 43.08,8.12 Q1.3 | 42.4,4.1 42.42,4.13 C6.1
  Top 0.406: 53.42,5.35 52.63,5.35 C14.1
  Top 0.508: U5.9 46.45,7.8 45.85,7.2 43.11,7.2 43.11,8.01 43.08,8.04 43.08,5.73 43.03,5.68 43.08,5.68 Q1.1 | R21.2 38.87,4.08 38.94,4.15 38.99,4.1 42.4,4.1 42.47,4.18
  Top 0.61: 44.78,5.6 44.76,5.6 44.68,5.68 44.63,5.63 43.84,5.63 Q1.1 | C13.2 38.99,4.1
  Top 0.813: C6.1 42.45,8.04 43.08,8.04 | 43.08,8.04 43.84,8.04 43.84,6.11 | 43.84,6.11 43.84,5.63 | 43.08,8.04 43.08,6.31 43.44,5.96 43.44,6.59 Q1.2 | 43.08,8.04 43.08,7.46 43.13,7.41 | C8.1 53.93,4.23 52.63,5.53 | 52.63,5.53 48.34,5.53 46.36,7.51 46.36,7.35 44.91,5.91 44.05,5.91 43.84,6.11 | 53.93,4.25 53.98,4.25 C12.1 53.98,5.45 R14.2 | 52.63,5.53 53.78,5.53 53.78,5.27 53.42,5.27 53.42,5.35
  Top 1.016: J2.+ 53.93,4.25 C8.1
  pour Top: 54.41,3.75 53.65,3.75 52.3,5.09 42.42,5.09 42.42,7.43 48.98,7.43 50.6,5.8 54.41,5.8
VCC  (via drill 0.41, 0.51)
  Top 0.203: 43.04,32.99 43.12,33.08 | R9.2 43.12,33.08 | 43.12,33.08 43.26,33.21
  Top 0.406: U2.13 20.93,29.69 | 20.93,29.69 20.83,29.69 C7.1 | C4.1 C7.1 | 40.97,30.42 v40.72,30.16 | v20.83,29.2 20.93,29.3 20.93,29.69 | R11.2 18.75,28.49 19.94,29.68 19.94,30 C7.1 | 42.5,31.18 43.06,31.74 43.77,31.03 43.23,31.03 43.21,31 43.21,30.99
  Top 0.61: Q6.3 43.21,30.99 | 43.21,30.99 41.55,30.99 v40.72,30.16 | R9.2 43.12,31.08 43.21,30.99
  Bottom 0.406: v40.72,30.16 40.26,30.62 21.75,30.62 20.83,29.71 v20.83,29.2 | v20.83,29.2 | v20.83,29.2 20.83,29.69
VIN_O  (via drill 0.3)
  Top 0.203: 30.94,12.21 30.94,13.93 30.89,13.93
  Top 0.254: R3.1 30.89,13.93
  Top 0.305: 30.97,16.8 30.99,16.83 31.07,16.83 | 31.07,16.83 30.94,16.83 | 30.97,15.99 31.07,16.09 31.07,16.83 | 31.07,16.83 30.97,16.73 VI.T
  Top 0.406: U6.3 37.94,19 38.23,19.29 38.23,20.61 37.93,20.92 36.83,20.92 36.89,20.92 U6.1 | 30.94,13.93 30.97,13.93 VI.T 30.97,15.99 | J1.1 70.27,12.48 v67.24,12.48 | v31.02,16.83 30.99,16.8 30.97,16.8
  Top 0.61: U6.1 35.51,20.9 C10.1 35.41,20.8 35.41,20.89
  Top 1.016: S1.2 32.4,10.75 30.94,12.21 30.94,13.93 30.94,16.83 30.94,18.17 33.66,20.89 35.41,20.89
  Bottom 0.406: v67.24,12.48 63.73,15.99 45.17,15.99 44.33,16.83 v31.02,16.83
WIFI_RST  (via drill 0.3)
  Top 0.203: 69.65,30.93 U1.39
  Top 0.254: WIFI.2 42,35.25 43.13,36.39 R6.1 v45.04,35.62 | v67.97,30.52 68.38,30.93 69.65,30.93
  Bottom 0.254: v45.04,35.62 45.55,35.12 49.61,31.05 50.14,30.52 v67.97,30.52

### Text on the board
tPlace: AD | GND | PWM
bPlace: 915MHz | 868MHz | 433MHz | RESET | IO0 | RXD | TXD | www.makerfabs.com | GND | SenseLora Soil Moisture V1.0 | VCC
tNames: ON | OFF | B+ | - | + | SOLAR | BAT | B-